# Altium schematic sheet 自动校准PH_V1.0.SchDoc
size A4
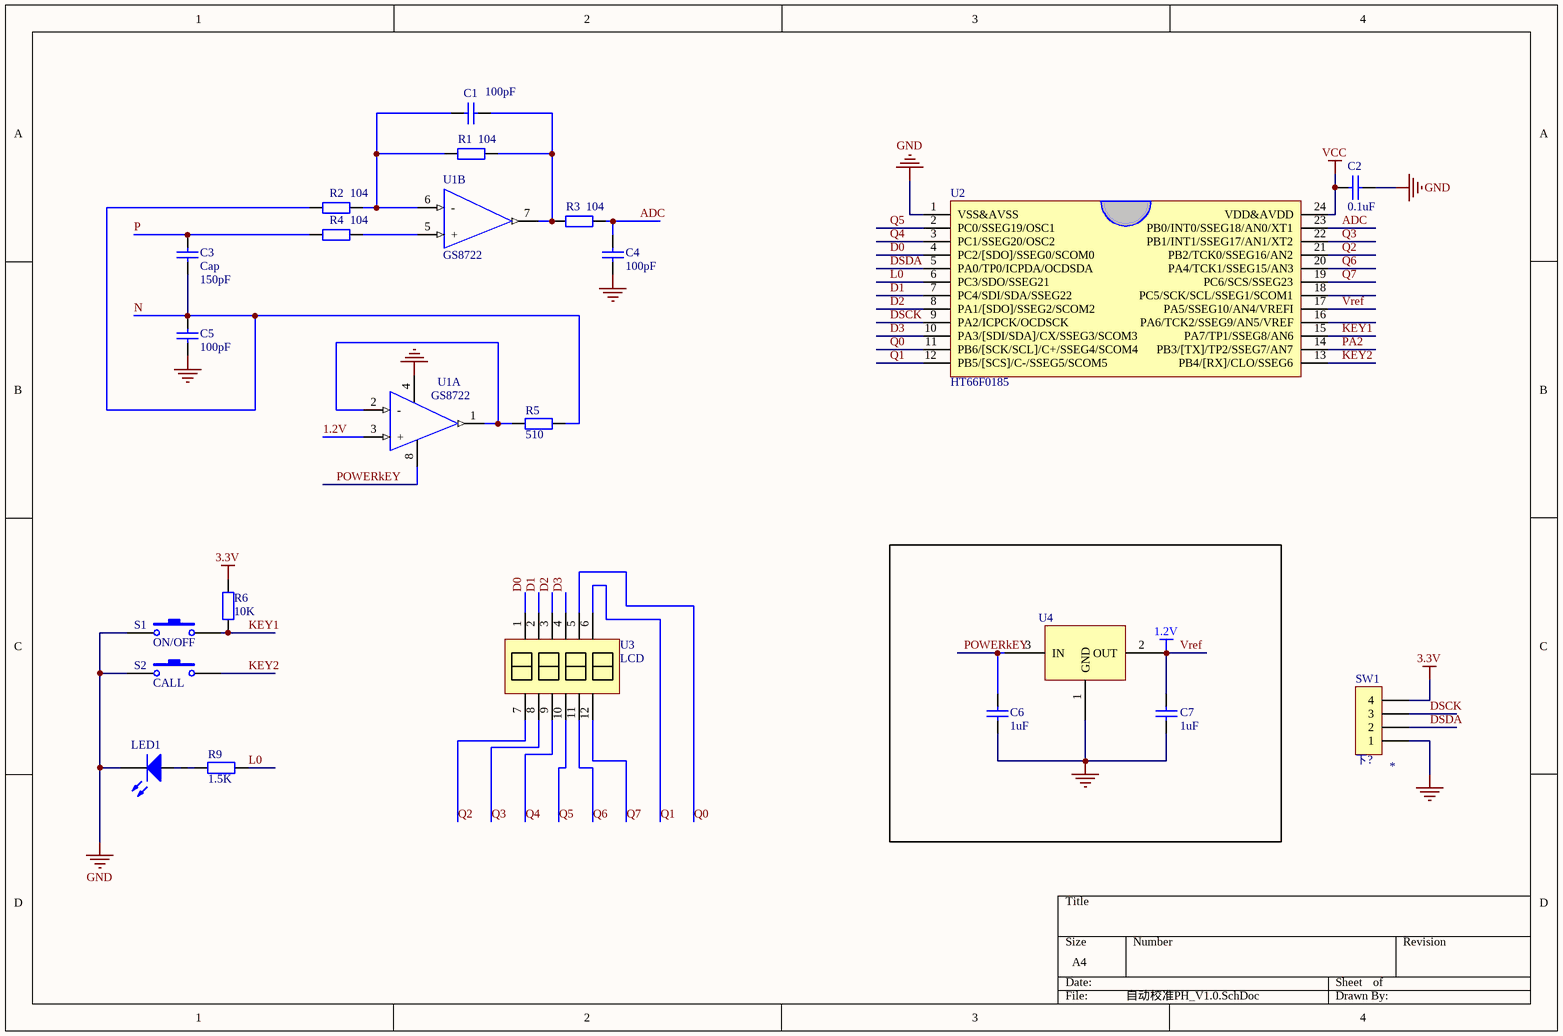
[diagram p0: 自动校准PH_V1.0.SchDoc]

## Parts
C1  value 100pF  [0603]  (hidden comment: Cap)
C2  0.1uF  [0603]
C3  Cap  value 150pF  [0603]
C4  value 100pF  [0603]  (hidden comment: Cap)
C5  value 100pF  [0603]  (hidden comment: Cap)
C6  1uF  [0603]
C7  1uF  [0603]
LED1  LED1  [LED-1]  (value not drawn)
R1  value 104  [0603]  (hidden comment: Res2)
R2  value 104  [0603]  (hidden comment: Res2)
R3  value 104  [0603]  (hidden comment: Res2)
R4  value 104  [0603]  (hidden comment: Res2)
R5  value 510  [0603]  (hidden comment: Res2)
R6  value 10K  [0603]  (hidden comment: Res2)
R9  value 1.5K  [0603]  (hidden comment: Res2)
S1  ON/OFF  [SPST-2]
S2  CALL  [SPST-2]
SW1  *  [HDR1X4]
U1  GS8722  [SOIC8]  (parts A,B of 2)
U2  HT66F0185
U3  LCD  [段码]
U4  (no value)  [SOT-23 - LDO]

## Nets
1.2V: C7.2 U1.3(+) U2.17(PA5/SSEG10/AN4/VREFI) U4.2(OUT)  [also labelled Vref]
3.3V: R6.2 SW1.4
GND: C2.2 C4.1 C5.1 C6.1 C7.1 LED1.2(K) S1.1 S2.1 SW1.1 U1.4(GND) U2.1(VSS&AVSS) U4.1(GND)
VCC: C2.1 U2.24(VDD&AVDD)
ADC: C4.2 R3.2 U2.23(PB0/INT0/SSEG18/AN0/XT1)
D0: U2.4(PC2/[SDO]/SSEG0/SCOM0) U3.1
D1: U2.7(PC4/SDI/SDA/SSEG22) U3.2
D2: U2.8(PA1/[SDO]/SSEG2/SCOM2) U3.3
D3: U2.10(PA3/[SDI/SDA]/CX/SSEG3/SCOM3) U3.4
DSCK: SW1.3 U2.9(PA2/ICPCK/OCDSCK)
DSDA: SW1.2 U2.5(PA0/TP0/ICPDA/OCDSDA)
KEY1: R6.1 S1.2 U2.15(PA7/TP1/SSEG8/AN6)
KEY2: S2.2 U2.13(PB4/[RX]/CLO/SSEG6)
L0: R9.2 U2.6(PC3/SDO/SSEG21)
N: C3.1 C5.2 R2.1 R5.2
P: C3.2 R4.1
PA2: U2.14(PB3/[TX]/TP2/SSEG7/AN7)
POWERkEY: C6.2 U1.8(VCC) U4.3(IN)
Q0: U2.11(PB6/[SCK/SCL]/C+/SSEG4/SCOM4) U3.5
Q1: U2.12(PB5/[SCS]/C-/SSEG5/SCOM5) U3.6
Q2: U2.21(PB2/TCK0/SSEG16/AN2) U3.7
Q3: U2.22(PB1/INT1/SSEG17/AN1/XT2) U3.8
Q4: U2.3(PC1/SSEG20/OSC2) U3.9
Q5: U2.2(PC0/SSEG19/OSC1) U3.10
Q6: U2.20(PA4/TCK1/SSEG15/AN3) U3.11
Q7: U2.19(PC6/SCS/SSEG23) U3.12
NetC1_1: C1.1 R1.2 R3.1 U1.7(1OUT)
NetC1_2: C1.2 R1.1 R2.2 U1.6(-)
NetLED1_1: LED1.1(A) R9.1
NetR4_2: R4.2 U1.5(+)
NetR5_1: R5.1 U1.1(1OUT) U1.2(-)

Not connected (* = marked no-connect by the designer): U2 16(PA6/TCK2/SSEG9/AN5/VREF) 18(PC5/SCK/SCL/SSEG1/SCOM1)

## Notes on the sheet
- (in symbol SIP4) 下?

## Library data of the parts
C1 C3-C5 = Cap: Capacitor; Published: 8-Jun-2000; LatestRevisionDate: 17-Jul-2002; LatestRevisionNote: Re-released for DXP Platform.; PackageReference: RAD-0.3; Publisher: Altium Limited
C2 = CAP: Capacitor
C6 C7 = Cap: Capacitor; Manufacturer: Generic Components; Class: Passive; Value: 0.1uF / 0805; Published: 08/06/2000; Publisher: Altium Hobart Technology Centre; SubClass: Capacitor
LED1 = LED1: Typical RED GaAs LED; Published: 8-Jun-2000; LatestRevisionDate: 08-Jul-2005; LatestRevisionNote: Mech Layer 1 removed.; PackageReference: LED-1; Publisher: Altium Limited; PackageDescription: LED; 2 Leads
R1-R6 R9 = Res2: Resistor; Published: 8-Jun-2000; LatestRevisionDate: 17-Jul-2002; LatestRevisionNote: Re-released for DXP Platform.; PackageReference: AXIAL-0.4; Publisher: Altium Limited
S1 S2 = SW-PB: Switch; Published: 24-Mar-1999; LatestRevisionDate: 17-Jul-2002; LatestRevisionNote: Re-released for DXP Platform.; PackageReference: SPST-2; Publisher: Altium Limited; PackageDescription: Switch; 2 Leads
SW1 = SIP4: jointbar
U1 = LM358: LM358-SOP8
U3 = 断码屏-4
U4 = LM1117